# EAGLE design NO NC COM (EAGLE 7.7.0)
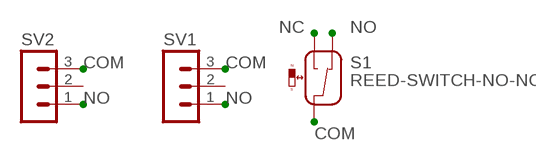
[diagram p0: schematic, sheet 1]

## Parts
S1  REED-SWITCH-NO-NC  [MK6-8-C]
SV1  MA03-1  [MA03-1]
SV2  MA03-1  [MA03-1]

## Nets
COM: S1.COM SV1.3 SV2.3
NC: S1.NO
NO: S1.NC SV1.1 SV2.1
Unconnected: SV1.2 SV2.2

## Library data of the parts
S1 = switch-reed:REED-SWITCH-NO-NC: Reed Sensor NO NC
SV1 SV2 = con-lstb:MA03-1: PIN HEADER; OC_FARNELL: unknown; OC_NEWARK: unknown

## Board
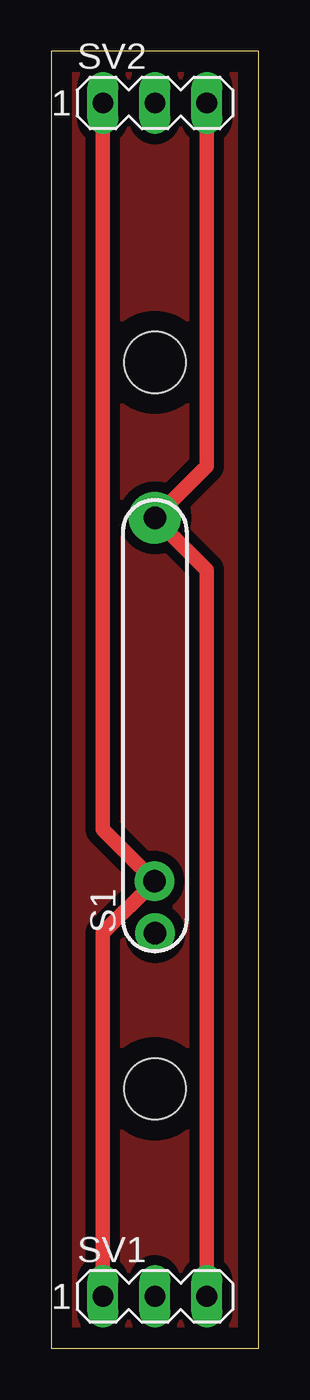
[diagram p1: board, top side]

Size 10.16 x 63.51 mm. Coordinates in mm from the lower left corner, seen from the top.
Outline: 0,0.01 10.16,0 10.16,63.51 0,63.51 0,0.01
Copper layers (1*16): Top 0.035mm / dielectric 1.5mm / Bottom 0.035mm
Design rules "default *": minimum track width 10mil, minimum drill 24mil, track to track 0.5mm, track to pad 0.5mm, pad to pad 0.5mm, via to via 0.5mm, smd to smd 8mil, copper to edge 40mil, drill to drill 8mil, minimum pad ring 10mil, minimum via ring 8mil, stop-mask expansion 4mil, vias tented up to drill 0mil, thermal gap 10mil
Holes 3 mm at 5.08,12.71 5.08,48.27

### Footprints (pad centres in the part's own frame; a part is rotated, then mirrored left to right if it is on the bottom)
MK6-8-C = drill 0.6 pad 1.016: COM 10.16,0; NC -7.62,0; NO -10.16,0
MA03-1 = drill 1.016 long: 1 -2.54,0; 2 0,0; 3 2.54,0

### Placement (x,y rotation side)
S1  5.08,30.49 90 top
SV1  5.08,2.55 0 top
SV2  5.08,60.97 0 top

### Tracks (layer width: path | path; a pad name or v marks a point on that pad's centre or on a via)
COM
  Top 0.7: SV2.3 7.62,43.19 S1.COM 7.62,38.11 SV1.3
N$3  (via drill 1.1 pad 2.54)
  other vias: 5.08,40.66
N$4  (via drill 1.1 pad 1.93)
  other vias: 5.06,22.88
N$5  (via drill 1.1 pad 1.93)
  other vias: 5.09,20.33
N$6
  pour Top: 0,63.51 10.16,63.51 10.16,0.01 0,0.01
NO
  Top 0.7: SV2.1 2.54,25.41 S1.NC 2.54,20.33 SV1.1